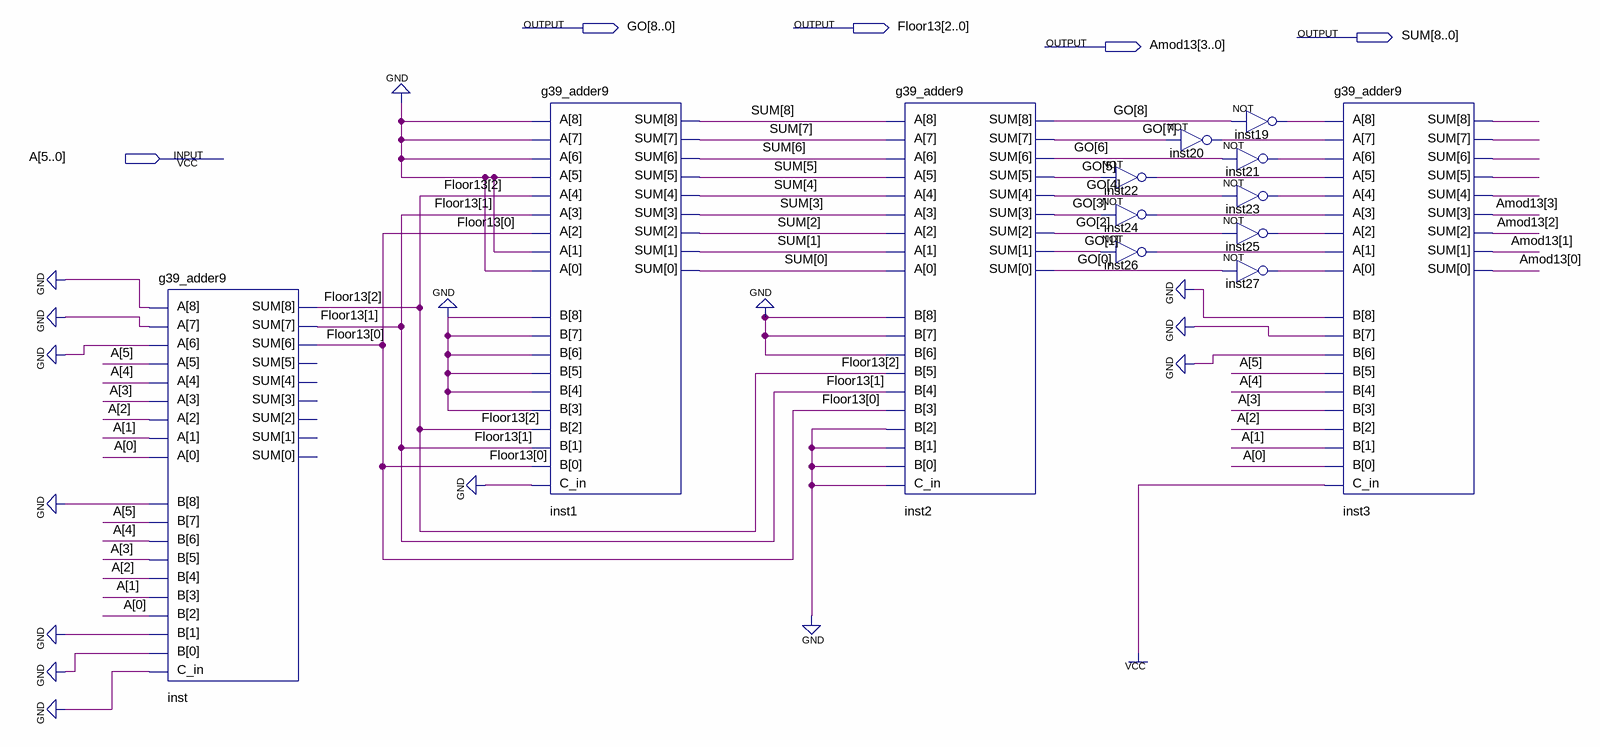
[diagram p0: schematic sheet]
// Quartus schematic g39_Modulo_13.bdf as structural Verilog: 13 symbols, 5 pins
module g39_Modulo_13 (
  input  [5:0] A,
  output [8:0] GO,
  output [2:0] Floor13,
  output [8:0] SUM,
  output [3:0] Amod13
);

  wire inst3_sum, inst3_sum_2, inst3_sum_3, inst3_sum_4, inst3_sum_5, inst19_out, inst20_out, inst21_out,
       inst22_out, inst23_out, inst24_out, inst25_out, inst26_out, inst27_out;
  wire [8:0] inst_sum_open;  // unused outputs

  g39_adder9 inst (.C_in(1'b0), .A({3'b000, A}), .B({1'b0, A, 2'b00}), .SUM({Floor13, inst_sum_open[5:0]}));
  g39_adder9 inst1 (.C_in(1'b0), .A({4'b0000, Floor13, 2'b00}), .B({{6{1'b0}}, Floor13}), .SUM(SUM));
  g39_adder9 inst2 (.C_in(1'b0), .A(SUM), .B({3'b000, Floor13, 3'b000}), .SUM(GO));
  not inst22 (inst22_out, GO[5]);
  not inst24 (inst24_out, GO[3]);
  not inst26 (inst26_out, GO[1]);
  not inst20 (inst20_out, GO[7]);
  not inst19 (inst19_out, GO[8]);
  not inst21 (inst21_out, GO[6]);
  not inst23 (inst23_out, GO[4]);
  not inst25 (inst25_out, GO[2]);
  not inst27 (inst27_out, GO[0]);
  g39_adder9 inst3 (
    .C_in(1'b1),
    .A({inst19_out, inst20_out, inst21_out, inst22_out, inst23_out, inst24_out, inst25_out, inst26_out, inst27_out}),
    .B({3'b000, A}), .SUM({inst3_sum, inst3_sum_2, inst3_sum_3, inst3_sum_4, inst3_sum_5, Amod13}));
endmodule
